# Altium project 4-Axile-Drone.PrjPcb
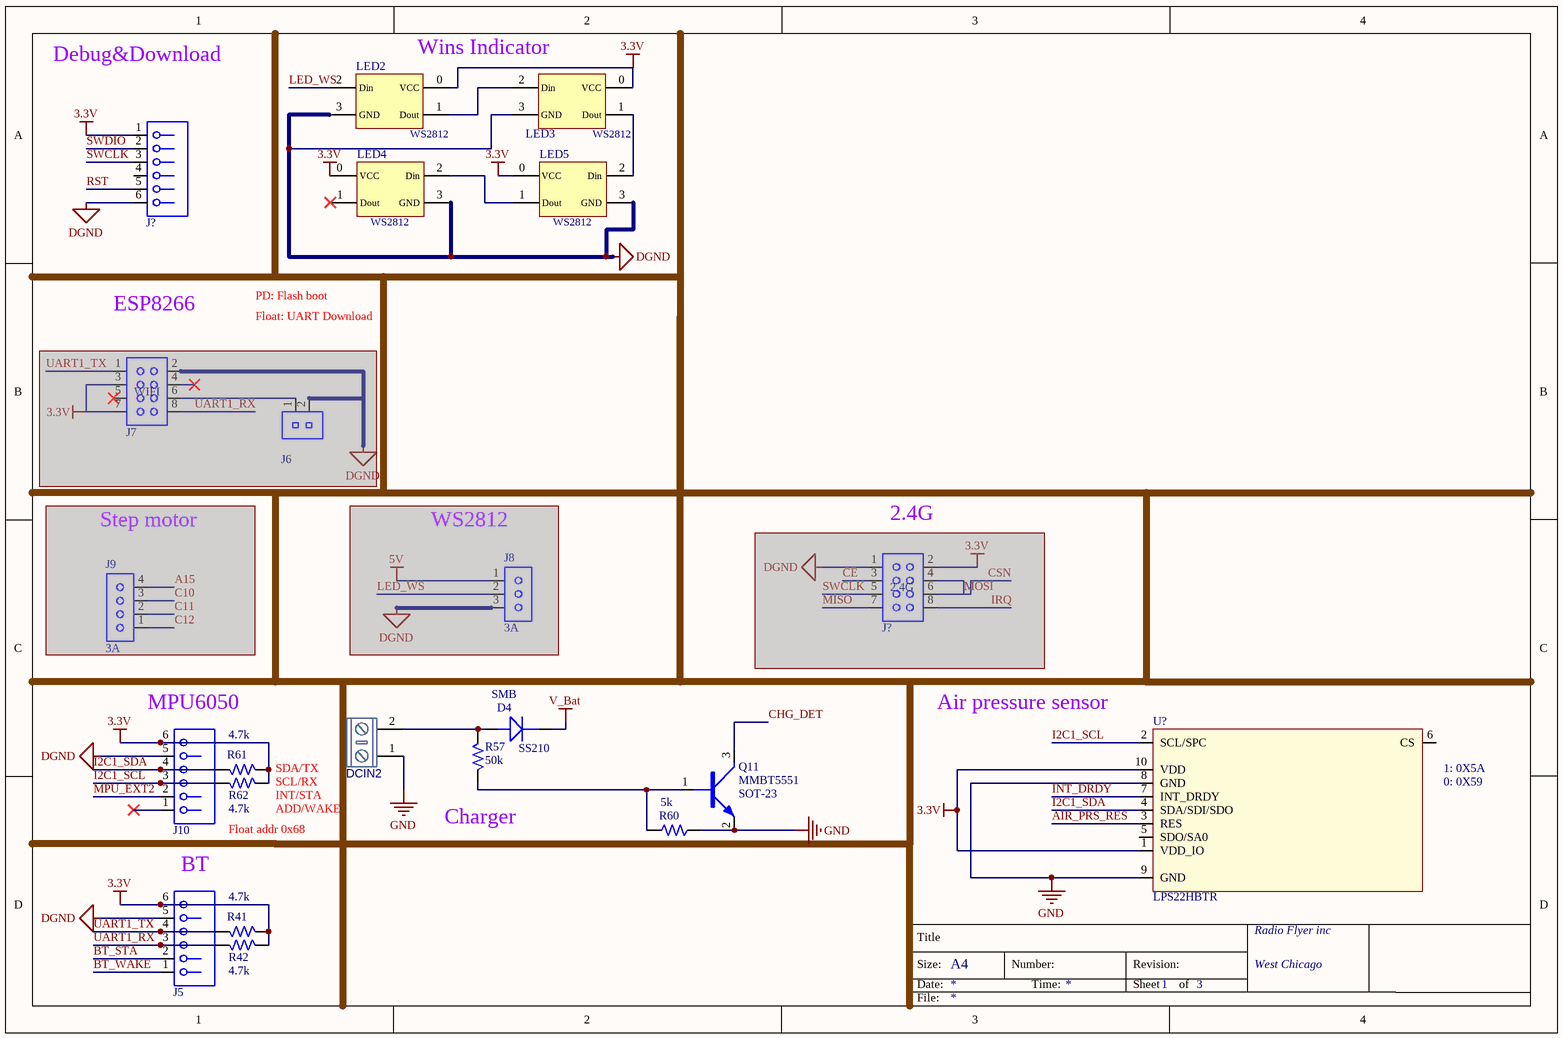
[diagram p0: Drone Connector.SchDoc]
3 sheets, 77 parts. Net scope: global (net labels, ports and power ports of the same name join across sheets).
Sheets:
  Drone Connector.SchDoc
  Done.SchDoc
  DroneMCU.SchDoc

## Sheet Drone Connector.SchDoc
size A4; Organization: Altium Limited; Address1: L3, 12a Rodborough Rd; Address2: Frenchs Forest; Address3: NSW; Address4: Australia 2086; SheetNumber: 1; SheetTotal: 3

### Parts
(Parts that share a designator on the sheet are numbered #1, #2 ... from top to bottom, then left to right.)
D4  RCD102100-0110  [SMB]  (value not drawn)
DCIN2  KF/WJ/DG 30x connecter  [KF/WJ/DG 301-2p-5.0mm]  (value not drawn)
J5  T690300121600  [CONN 6P PH=2.5mm RA XHB-6AW-KL]  (value not drawn)
J6  CCH254020-0102  [HOUSING 2P PH=2.54mm Jumper]  (value not drawn)  (masked out: inside a compile mask, not in the netlist)
J7  WIFI  [HEAD 8P 2X4 PH=2.54mm 90 H5mm_2.54-2X4AW-10.4]  (masked out: inside a compile mask, not in the netlist)
J8  Current: 3A  [HEAD 3P PH=2.54mm 180]  (hidden comment: CCP254010-0103)  (masked out: inside a compile mask, not in the netlist)
J9  Current: 3A  [HEAD 4P PH=2.54mm 180]  (hidden comment: CCP254260-0104)  (masked out: inside a compile mask, not in the netlist)
J10  T690300121600  [CONN 6P PH=2.5mm RA XHB-6AW-KL]  (value not drawn)
J?#1  T690300121600  [CONN 6P PH=2.5mm RA XHB-6AW-KL]  (value not drawn)
J?#2  2.4G  [HEAD 8P 2X4 PH=2.54mm 90 H5mm_2.54-2X4AW-10.4]  (masked out: inside a compile mask, not in the netlist)
LED2  WS2812  [WS2812]  (value not drawn)
LED3  WS2812  [WS2812]  (value not drawn)
LED4  WS2812  [WS2812]  (value not drawn)
LED5  WS2812  [WS2812]  (value not drawn)
Q11  Package: SOT-23  [SOT23-132-RW]  (hidden comment: RCN005551-0001)
R41  value 4.7k  [0603-RW]  (hidden comment: T5024421083A9)
R42  value 4.7k  [0603-RW]  (hidden comment: T5024421083A9)
R57  value 50k  [0603-RW]  (hidden comment: T5024421083A9)
R60  value 5k  [0603-RW]  (hidden comment: T5024421083A9)
R61  value 4.7k  [0603-RW]  (hidden comment: T5024421083A9)
R62  value 4.7k  [0603-RW]  (hidden comment: T5024421083A9)
U?  MFG Part: LPS22HBTR  [MSOP-10]  (hidden comment: T610300101698)

### Nets
3.3V: J5.6 J10.6 J?#1.1 LED2.0(VCC) LED3.0(VCC) LED4.0(VCC) LED5.0(VCC) R41.2 R42.2 R61.2 R62.2 U?.1(VDD_IO) U?.10(VDD)
DGND: J5.5 J10.5 J?#1.6 LED2.3(GND) LED3.3(GND) LED4.3(GND) LED5.3(GND)
GND: DCIN2.1 Q11.2(E) R60.2 U?.8(GND) U?.9(GND)
V_Bat: D4.2(K)
AIR_PRS_RES: U?.3(RES)
BT_STA: J5.2
BT_WAKE: J5.1
CHG_DET: Q11.3(C)
I2C1_SCL: J10.3 R62.1 U?.2(SCL/SPC)
I2C1_SDA: J10.4 R61.1 U?.4(SDA/SDI/SDO)
INT_DRDY: U?.7(INT_DRDY)  [project net I2C2_SDA]
LED_WS: LED2.2(Din)
MPU_EXT2: J10.2
RST: J?#1.5
SWCLK: J?#1.3
SWDIO: J?#1.2
UART1_RX: J5.3 R42.1
UART1_TX: J5.4 R41.1
NetD4_1: D4.1(A) DCIN2.2 R57.1
NetLED2_1: LED2.1(Dout) LED3.2(Din)
NetLED3_1: LED3.1(Dout) LED5.2(Din)
NetLED4_2: LED4.2(Din) LED5.1(Dout)
NetQ11_1: Q11.1(B) R57.2 R60.1

Not connected (* = marked no-connect by the designer): J10 1*; J?#1 4; LED4 1(Dout)*; U? 5(SDO/SA0) 6(CS)

### Notes on the sheet
- Debug&Download
- Wins Indicator
- ESP8266
- PD: Flash boot
- Float: UART Download
- (near J?#2) 2.4G
- Step motor
- (near J8) WS2812
- (near J10) MPU6050
- (near U?) Air pressure sensor
- SDA/TX
- SCL/RX
- (near U?) 1: 0X5A
- (near U?) 0: 0X59
- Float addr 0x68
- INT/STA
- ADD/WAKE
- (near R57) Charger
- BT
- Title
- Size:
- Date:
- A4
- Number:
- Time:
- Revision:
- Sheet
- of
- Radio Flyer inc
- West Chicago
- File:

### Library data of the parts
D4 = SS210: SWITC 100V 2A SS210 MIC G; SAP: T572005362246; Vendor Name: 深圳市春明电子有限公司; Vendor Code: 10020343; Type: DIODE; Optional: USD (和572004962246 交易幣別不一樣)帋ISHIDDEN=T|IS|IS|IS|IS|IS|IS; DIP&SMD: SMD; MFG: MIC; Voltage: 100V; Current: 2A; Customer Specific: N/A; MFG Part: SS210; Package: SMB
DCIN2 = KF/WJ/DG 30x: 接线端子 2Pin
J5 J10 J?#1 = CONN PH 6P PH=2.5mm RA XHB-6AW-KL: CONNECTOR 6PIN P=2.5 WHITE 90 K; Value: 2.5mm; MFG: 金佳电子; CREATE_NAME: Nathan; DIP&SMD: DIP; SAP: T690300121600; MFG Part: XHB-6AW-KL; Vendor Name: *; Vendor Code: *; Type: Connector; Current: *; CREATE_TIME: 27-Sep-2017
J6 = HOUSING 2P PH=2.54mm Jumper: HOUSING SIL Jumper 2P 90059-1007 Molex; Value: 2.54mm; SAP: T690300000900; Vendor Name: 深圳市利民丰电子有限公司; Vendor Code: 10020373; DIP&SMD: DIP; Current: 3A Jumper; MFG: *; MFG Part: *; Type: Connector
J7 J?#2 = HEAD 8P 2X4 PH=2.54mm 90 H5mm_2.54-2X4AW-10.4: 2X4P P:2.54MM 90° DIP K; Value: 2.54mm; SAP: T690300110000; MFG: JINJIA; CREATE_NAME: Nathan; MFG Part: 2.54-2X4AW-10.4; Vendor Name: *; Vendor Code: *; Type: Connector; Current: *; CREATE_TIME: 12-Sep-2017; DIP&SMD: DIP
J8 = HEAD 3P PH=2.54mm 180: HEAD PIN 3P P2.54*H11.6MM; Value: 2.54mm; SAP: T690300031100; Vendor Name: 深圳市利民丰电子有限公司; Vendor Code: 10020373; DIP&SMD: DIP; MFG: *; MFG Part: *; Type: Connector
J9 = HEAD 4P PH=2.54mm 180 H11.5mm: HEAD PIN 4P P2.54xH11.5MM; Value: 2.54mm; SAP: T690300023200; Vendor Name: 亿源电子有限公司; Vendor Code: 10009989; DIP&SMD: DIP; MFG: *; MFG Part: *; Type: Connector
Q11 = MMBT5551: XISTR NPN MMBT5551 SOT-23 FAIRCHILD; SAP: T581001790453; MFG: 宣瑜; Vendor Code: 10020343; Vendor Name: 深圳市春明电子有限公司; DIP&SMD: SMD; Power: *; Voltage: *; Type: NPN; Customer Specific: N/A; MFG Part: MMBT5551
R41 R42 R57 R60-R62 = RES0201 1/20W 1% 4.42K OHM_WALSIN: CHIP 4.42K OHM 200PPM +-1% 0201 WALS L; MFG Part: WR02X4421FAL; Power: 1/20W; MFG: WALSIN (華新); TOL: 1%; CREATE_NAME: Nathan; DIP&SMD: SMD; Vendor Code: *; SAP: T5024421083A9; Vendor Name: *; Type: Resistor; PACKAGE: 0603; CREATE_TIME: 23-July-2019; Customer Specific: N/A
U? = WT51F108S-MG10BWT: MCU WT51F108S-MG10BWT MSOP WELTREN K; MFG: Weltrend; CREATE_NAME: Nathan; DIP&SMD: SMD; Vendor Code: *; Vendor Name: *; SAP: T610300101698; Type: IC; CREATE_TIME: 04-Mar-2019; Customer Specific: N/A

## Sheet Done.SchDoc
size A4; Organization: Altium Limited; Address1: L3, 12a Rodborough Rd; Address2: Frenchs Forest; Address3: NSW; Address4: Australia 2086; SheetNumber: 1; SheetTotal: 2
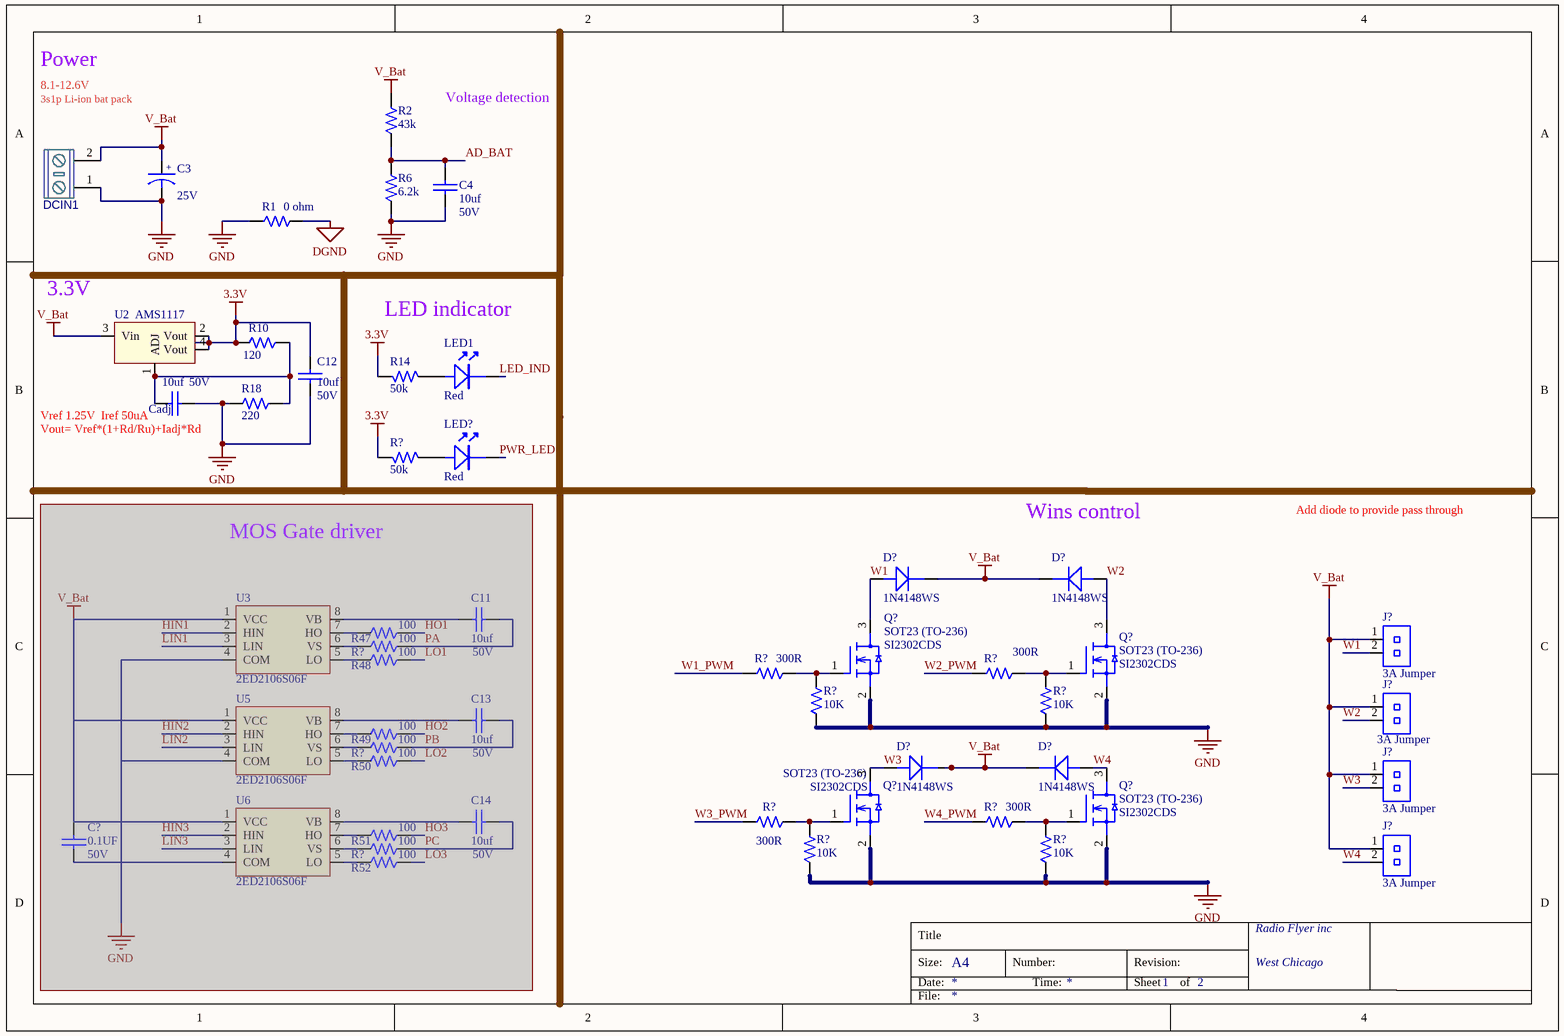
[diagram p1: Done.SchDoc]

### Parts
(Parts that share a designator on the sheet are numbered #1, #2 ... from top to bottom, then left to right.)
C3  Voltage: 25V  [CASE - G]  (hidden comment: PBE099550-4710)
C4  value 10uf  Voltage: 50V  [CAPC0603-RW]  (hidden comment: PXL456470-1530)
C11  value 10uf  Voltage: 50V  [CAPC0603-RW]  (hidden comment: PXL456470-1530)  (masked out: inside a compile mask, not in the netlist)
C12  value 10uf  Voltage: 50V  [CAPC0603-RW]  (hidden comment: PXL456470-1530)
C13  value 10uf  Voltage: 50V  [CAPC0603-RW]  (hidden comment: PXL456470-1530)  (masked out: inside a compile mask, not in the netlist)
C14  value 10uf  Voltage: 50V  [CAPC0603-RW]  (hidden comment: PXL456470-1530)  (masked out: inside a compile mask, not in the netlist)
C?  value 0.1UF  Voltage: 50V  [CAPC0603-RW]  (hidden comment: PXL456470-1530)  (masked out: inside a compile mask, not in the netlist)
Cadj  value 10uf  Voltage: 50V  [CAPC0603-RW]  (hidden comment: PXL456470-1530)
D?#1  RCD114148-0020  [SOD-323]  (value not drawn)
D?#2  RCD114148-0020  [SOD-323]  (value not drawn)
D?#3  RCD114148-0020  [SOD-323]  (value not drawn)
D?#4  RCD114148-0020  [SOD-323]  (value not drawn)
DCIN1  KF/WJ/DG 30x connecter  [KF/WJ/DG 301-2p-5.0mm]  (value not drawn)
J?#3  Current: 3A Jumper  [HOUSING 2P PH=2.54mm Jumper]  (hidden comment: CCH254020-0102)
J?#4  Current: 3A Jumper  [HOUSING 2P PH=2.54mm Jumper]  (hidden comment: CCH254020-0102)
J?#5  Current: 3A Jumper  [HOUSING 2P PH=2.54mm Jumper]  (hidden comment: CCH254020-0102)
J?#6  Current: 3A Jumper  [HOUSING 2P PH=2.54mm Jumper]  (hidden comment: CCH254020-0102)
LED1  Color: Red  [LED1206-RED]  (hidden comment: LED1206R_23-21\R6C-AM1N2AY\2A)
LED?  Color: Red  [LED1206-RED]  (hidden comment: LED1206R_23-21\R6C-AM1N2AY\2A)
Q?#1  Package: SOT23 (TO-236)  [SOT23-132-RW]  (hidden comment: SI2302CDS)
Q?#2  Package: SOT23 (TO-236)  [SOT23-132-RW]  (hidden comment: SI2302CDS)
Q?#3  Package: SOT23 (TO-236)  [SOT23-132-RW]  (hidden comment: SI2302CDS)
Q?#4  Package: SOT23 (TO-236)  [SOT23-132-RW]  (hidden comment: SI2302CDS)
R1  value 0 ohm  [0603-RW]  (hidden comment: T502210202399)
R2  value 43k  [0603-RW]  (hidden comment: T5024421083A9)
R6  value 6.2k  [0603-RW]  (hidden comment: T5024421083A9)
R10  value 120  [0603-RW]  (hidden comment: T5024421083A9)
R14  value 50k  [0603-RW]  (hidden comment: T5024421083A9)
R18  value 220  [0603-RW]  (hidden comment: T5024421083A9)
R47  value 100  [0603-RW]  (hidden comment: T5024421083A9)  (masked out: inside a compile mask, not in the netlist)
R48  value 100  [0603-RW]  (hidden comment: T5024421083A9)  (masked out: inside a compile mask, not in the netlist)
R49  value 100  [0603-RW]  (hidden comment: T5024421083A9)  (masked out: inside a compile mask, not in the netlist)
R50  value 100  [0603-RW]  (hidden comment: T5024421083A9)  (masked out: inside a compile mask, not in the netlist)
R51  value 100  [0603-RW]  (hidden comment: T5024421083A9)  (masked out: inside a compile mask, not in the netlist)
R52  value 100  [0603-RW]  (hidden comment: T5024421083A9)  (masked out: inside a compile mask, not in the netlist)
R?#1  value 50k  [0603-RW]  (hidden comment: T5024421083A9)
R?#2  value 100  [0603-RW]  (hidden comment: T5024421083A9)  (masked out: inside a compile mask, not in the netlist)
R?#3  value 300R  [0603-RW]  (hidden comment: T5024421083A9)
R?#4  value 10K  [0603-RW]  (hidden comment: T5024421083A9)
R?#5  value 300R  [0603-RW]  (hidden comment: T5024421083A9)
R?#6  value 10K  [0603-RW]  (hidden comment: T5024421083A9)
R?#7  value 100  [0603-RW]  (hidden comment: T5024421083A9)  (masked out: inside a compile mask, not in the netlist)
R?#8  value 300R  [0603-RW]  (hidden comment: T5024421083A9)
R?#9  value 10K  [0603-RW]  (hidden comment: T5024421083A9)
R?#10  value 300R  [0603-RW]  (hidden comment: T5024421083A9)
R?#11  value 10K  [0603-RW]  (hidden comment: T5024421083A9)
R?#12  value 100  [0603-RW]  (hidden comment: T5024421083A9)  (masked out: inside a compile mask, not in the netlist)
U2  AMS1117  [SOT223]
U3  T610900027257  [SO8]  (value not drawn)  (masked out: inside a compile mask, not in the netlist)
U5  T610900027257  [SO8]  (value not drawn)  (masked out: inside a compile mask, not in the netlist)
U6  T610900027257  [SO8]  (value not drawn)  (masked out: inside a compile mask, not in the netlist)

### Nets
3.3V: C12.1 R10.2 R14.1 R?#1.1 U2.2(Vout) U2.4(Vout)
DGND: R1.2
GND: C3.2 C4.2 C12.2 Cadj.2 DCIN1.1 Q?#1.2(S) Q?#2.2(S) Q?#3.2(S) Q?#4.2(S) R1.1 R6.2 R18.2 R?#4.2 R?#6.2 R?#9.2 R?#11.2
V_Bat: C3.1 D?#1.2(K) D?#2.2(K) D?#3.2(K) D?#4.2(K) DCIN1.2 J?#3.1 J?#4.1 J?#5.1 J?#6.1 R2.1 U2.3(Vin)
AD_BAT: C4.1 R2.2 R6.1
LED_IND: LED1.2(K)
PWR_LED: LED?.2(K)
W1: D?#1.1(A) J?#3.2 Q?#1.3(D)
W1_PWM: R?#3.1
W2: D?#2.1(A) J?#4.2 Q?#2.3(D)
W2_PWM: R?#5.1
W3: D?#3.1(A) J?#5.2 Q?#3.3(D)
W3_PWM: R?#8.1
W4: D?#4.1(A) J?#6.2 Q?#4.3(D)
W4_PWM: R?#10.1
NetCadj_1: Cadj.1 R10.1 R18.1 U2.1(ADJ)
NetLED1_1: LED1.1(A) R14.2
NetLED?_1: LED?.1(A) R?#1.2
NetQ?#1_1: Q?#1.1(G) R?#3.2 R?#4.1
NetQ?#2_1: Q?#2.1(G) R?#5.2 R?#6.1
NetQ?#3_1: Q?#3.1(G) R?#8.2 R?#9.1
NetQ?#4_1: Q?#4.1(G) R?#10.2 R?#11.1

### Notes on the sheet
- Power
- 3s1p Li-ion bat pack
- 8.1-12.6V
- Voltage detection
- (near U2) 3.3V
- LED indicator
- (near Cadj) Vref 1.25V  Iref 50uA
- (near Cadj) Vout= Vref*(1+Rd/Ru)+Iadj*Rd
- Wins control
- Add diode to provide pass through
- MOS Gate driver
- Title
- Size:
- Date:
- A4
- Number:
- Time:
- Revision:
- Sheet
- of
- Radio Flyer inc
- West Chicago
- File:
- (in symbol CAP E 470uF 25V 20% SMD) +

### Library data of the parts
C3 = CAP E 470uF 25V 20% SMD: CHIP ELECT 470uF 25V 20% D10xL10 105; SAP: T551471445000; Vendor Name: 东莞市晴远电子有限公司; Vendor Code: 10010262; Type: Capacitor; DIP&SMD: SMD; PACKAGE: CASE - G; MFG: *; MFG Part: *; Other: *; Tolerance: 20%; Customer Specific: N/A
C4 C11-C14 C? = CAP0603 0.015uF 50V 10%: GP CHIP CAP 0.015uF 50V 10% 0603 TYPE X7R; SAP: T542021537508; Vendor Code: 10010262; Vendor Name: 东莞市晴远电子有限公司; Type: Capacitor; DIP&SMD: SMD; PACKAGE: CAPC0603; MFG: *; MFG Part: *; Other: X7R; Tolerance: 10%; Customer Specific: N/A
Cadj = CAP0603 0.015uF 50V 10%: GP CHIP CAP 0.015uF 50V 10% 0603 TYPE X7R; SAP: T542021537508; Vendor Code: 10010262; Vendor Name: 东莞市晴远电子有限公司; DIP&SMD: SMD; PACKAGE: CAPC0603; MFG: *; MFG Part: *; Other: X7R; Tolerance: 10%; Type: Capacitor; Customer Specific: N/A
D?#1-D?#4 = 1N4148WS: DIODE SW 1N4148 VF=0.7V SOD-323; MFG: TW SEMICONDUCTOR; SAP: T572005070208; Voltage: 100V; Current: 150MA; DIP&SMD: SMD; Vendor Name: *; Vendor Code: *; Type: DIODE; Package: SOD-323; Customer Specific: N/A; MFG Part: 1N4148WS
DCIN1 = KF/WJ/DG 30x: 接线端子 2Pin
J?#3-J?#6 = HOUSING 2P PH=2.54mm Jumper: HOUSING SIL Jumper 2P 90059-1007 Molex; Value: 2.54mm; SAP: T690300000900; Vendor Name: 深圳市利民丰电子有限公司; Vendor Code: 10020373; DIP&SMD: DIP; MFG: *; MFG Part: *; Type: Connector
LED1 LED? = LED1206R_23-21\R6C-AM1N2AY\2A: CHIP LED RED TYPE 1206; MFG: EVERLIGHT; DIP&SMD: SMD; CREATE_NAME: Nathan; MFG Part: 23-21\R6C-AM1N2AY\2A; SAP: *; Package: 1206; Type: LED; CREATE_TIME: 18-Aug-2020
Q?#1-Q?#4 = SI2302CDS: NMOS FET-Si2302CDS; MFG: VISHAY; CREATE_NAME: Nathan; DIP&SMD: SMD; SAP: *; Power: *; Vendor Code: *; Vendor Name: *; Voltage: *; Current: *; Type: NMOS; CREATE_TIME: 17-Nov-2020; Customer Specific: N/A; MFG Part: SI2302CDS
R1 = RES0603 1/16W 1% 21K OMH_WALSIN: CHIP 21K OHM 100PPM +-1% 0603 WALS L; TOL: 1%; MFG: WALSIN (華新); Power: 1/10W; CREATE_NAME: Nathan; DIP&SMD: SMD; SAP: T502210202399; Package: 0603; MFG Part: *; Vendor Code: *; Vendor Name: *; Type: Resistor; CREATE_TIME: 08-Feb-2018; Customer Specific: N/A
R2 R6 R10 R14 R18 R47-R52 R?#1-R?#12 = RES0201 1/20W 1% 4.42K OHM_WALSIN: as R41 on sheet Drone Connector; Vendor Code: *; SAP: T5024421083A9; Vendor Name: *; Type: Resistor; PACKAGE: 0603; CREATE_TIME: 23-July-2019; Customer Specific: N/A
U2 = AMS1117: 800mA LOW DROPOUT VOLTAGE REGULATOR , SOT-223; MFG: Advanced Monolithic Systems; CREATE_NAME: Nathan; DIP&SMD: SMD; SAP: *; Vendor Code: *; Vendor Name: *; Type: IC; CREATE_TIME: 17-Nov-2020; Package: SOT-223; Customer Specific: N/A; MFG Part: AMS1117
U3 U5 U6 = 2ED2106S06F: DRIVER 2ED2106S06F DSO-8 INFINEO K; MFG: Infineon; CREATE_NAME: Nathan; DIP&SMD: SMD; Vendor Code: *; Vendor Name: *; SAP: T610900027257; Type: IC; CREATE_TIME: 14-Apr-2020; Customer Specific: N/A; MFG Part: 2ED2106S06F

## Sheet DroneMCU.SchDoc
size A4; SheetNumber: 3; SheetTotal: 3
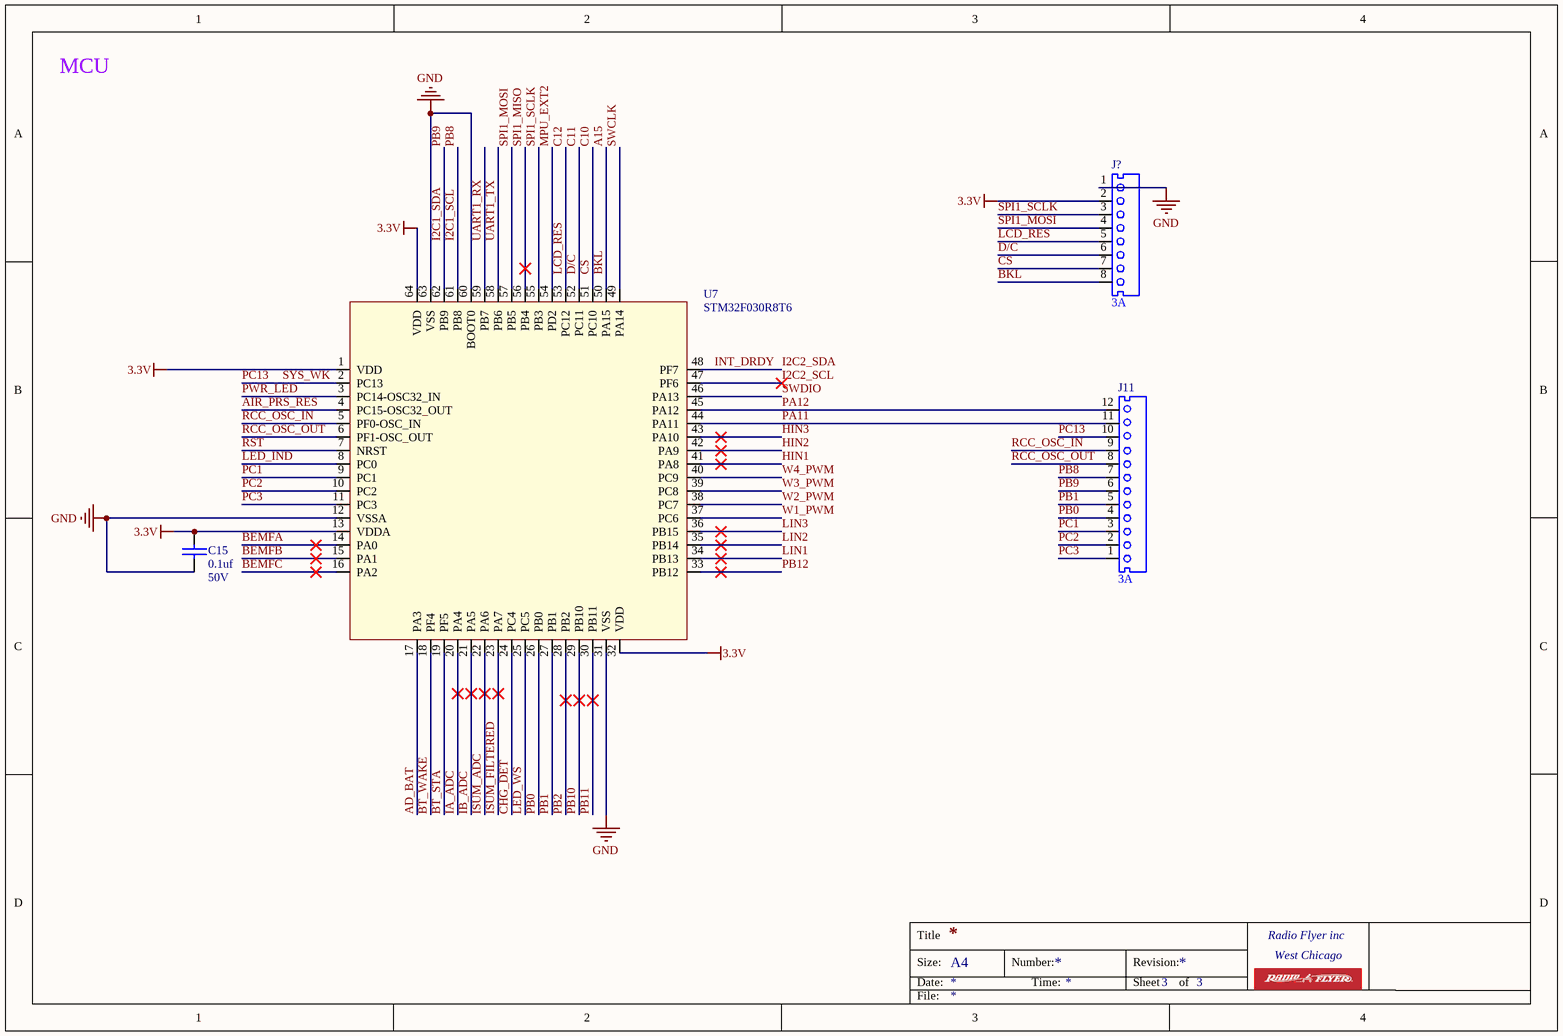
[diagram p2: DroneMCU.SchDoc]

### Parts
(Parts that share a designator on the sheet are numbered #1, #2 ... from top to bottom, then left to right.)
C15  value 0.1uf  Voltage: 50V  [CAPC0603-RW]  (hidden comment: PXL456470-1530)
J11  Current: 3A  [CONN 12P PH=2.5 ST HAA250A-12A]  (hidden comment: T690300029300)
J?#7  Current: 3A  [CONN 8P PH=2.5 ST TJC3-8A-CS]  (hidden comment: T690300135100)
U7  MFG Part: STM32F030R8T6  [QFP50P1200X1200X160-64N]  (hidden comment: T610300097225)

### Nets
3.3V: C15.2 J?#7.2 U7.1(VDD) U7.13(VDDA) U7.32(VDD) U7.64(VDD)
GND: C15.1 J?#7.1 U7.12(VSSA) U7.31(VSS) U7.60(BOOT0) U7.63(VSS)
A15: J?#7.8 U7.50(PA15)  [also labelled BKL]
AD_BAT: U7.17(PA3)
AIR_PRS_RES: U7.4(PC15-OSC32_OUT)
BEMFA: U7.14(PA0)
BEMFB: U7.15(PA1)
BEMFC: U7.16(PA2)
BT_STA: U7.19(PF5)
BT_WAKE: U7.18(PF4)
C10: J?#7.7 U7.51(PC10)  [also labelled CS]
C11: J?#7.6 U7.52(PC11)  [also labelled D/C]
C12: J?#7.5 U7.53(PC12)  [also labelled LCD_RES]
CHG_DET: U7.24(PC4)
HIN1: U7.41(PA8)
HIN2: U7.42(PA9)
HIN3: U7.43(PA10)
I2C1_SCL: J11.7 U7.61(PB8)  [also labelled PB8]
I2C1_SDA: J11.6 U7.62(PB9)  [also labelled PB9]
I2C2_SCL: U7.47(PF6)
I2C2_SDA: U7.48(PF7)  [also labelled INT_DRDY]
IA_ADC: U7.20(PA4)
IB_ADC: U7.21(PA5)
ISUM_ADC: U7.22(PA6)
ISUM_FILTERED: U7.23(PA7)
LED_IND: U7.8(PC0)
LED_WS: U7.25(PC5)
LIN1: U7.34(PB13)
LIN2: U7.35(PB14)
LIN3: U7.36(PB15)
MPU_EXT2: U7.54(PD2)
PA11: J11.11 U7.44(PA11)
PA12: J11.12 U7.45(PA12)
PB0: J11.4 U7.26(PB0)
PB1: J11.5 U7.27(PB1)
PB2: U7.28(PB2)
PB10: U7.29(PB10)
PB11: U7.30(PB11)
PB12: U7.33(PB12)
PC1: J11.3 U7.9(PC1)
PC2: J11.2 U7.10(PC2)
PC3: J11.1 U7.11(PC3)
PC13: J11.10 U7.2(PC13)  [also labelled SYS_WK]
PWR_LED: U7.3(PC14-OSC32_IN)
RCC_OSC_IN: J11.9 U7.5(PF0-OSC_IN)
RCC_OSC_OUT: J11.8 U7.6(PF1-OSC_OUT)
RST: U7.7(NRST)
SPI1_MISO: U7.56(PB4)
SPI1_MOSI: J?#7.4 U7.57(PB5)
SPI1_SCLK: J?#7.3 U7.55(PB3)
SWCLK: U7.49(PA14)
SWDIO: U7.46(PA13)
UART1_RX: U7.59(PB7)
UART1_TX: U7.58(PB6)
W1_PWM: U7.37(PC6)
W2_PWM: U7.38(PC7)
W3_PWM: U7.39(PC8)
W4_PWM: U7.40(PC9)

### Notes on the sheet
- MCU
- Title
- Size:
- Date:
- A4
- Number:
- Time:
- Revision:
- Sheet
- of
- Radio Flyer inc
- West Chicago
- File:

### Library data of the parts
C15 = CAP0603 0.015uF 50V 10%: as C4 on sheet Done; PACKAGE: CAPC0603; MFG: *; MFG Part: *; Other: X7R; Tolerance: 10%; Customer Specific: N/A
J11 = CONN 12P PH=2.5 ST HAA250A-12A: CONNECTOR 12 PIN P:2.5MM P2.54-12 K; Value: 2.5mm; MFG: 金科基; CREATE_NAME: Nathan; DIP&SMD: DIP; SAP: T690300029300; MFG Part: HAA250A-12A; Vendor Name: *; Vendor Code: *; Type: Connector; CREATE_TIME: 10-Aug-2017
J?#7 = CONN 8P PH=2.5 ST TJC3-8A-CS: CONN 8PIN P2.5 M\180 TJC3-8A-CS K; Value: 2.5mm; MFG: JINJIA; CREATE_NAME: Nathan; DIP&SMD: DIP; SAP: T690300135100; MFG Part: TJC3-8A-CS; Vendor Name: *; Vendor Code: *; Type: Connector; CREATE_TIME: 21-Mar-2018
U7 = STM32F030RCT6TR: MCU STM32F030RCT6TR LQFP64 ST K; MFG: ST     (STM意法半導體); CREATE_NAME: Nathan; DIP&SMD: SMD; SAP: T610300097225; Type: IC; CREATE_TIME: 02-NOV-2017; Customer Specific: N/A

## Nets that join several sheets
3.3V: Drone Connector (13 pins), Done (6 pins), DroneMCU (6 pins)
DGND: Drone Connector (7 pins), Done (R1.2)
GND: Drone Connector (5 pins), Done (16 pins), DroneMCU (6 pins)
V_Bat: Drone Connector (D4.2), Done (12 pins)
AD_BAT: Done (C4.1 R2.2 R6.1), DroneMCU (U7.17)
AIR_PRS_RES: Drone Connector (U?.3), DroneMCU (U7.4)
BT_STA: Drone Connector (J5.2), DroneMCU (U7.19)
BT_WAKE: Drone Connector (J5.1), DroneMCU (U7.18)
CHG_DET: Drone Connector (Q11.3), DroneMCU (U7.24)
I2C1_SCL: Drone Connector (J10.3 R62.1 U?.2), DroneMCU (J11.7 U7.61)
I2C1_SDA: Drone Connector (J10.4 R61.1 U?.4), DroneMCU (J11.6 U7.62)
I2C2_SDA: Drone Connector (U?.7), DroneMCU (U7.48)
LED_IND: Done (LED1.2), DroneMCU (U7.8)
LED_WS: Drone Connector (LED2.2), DroneMCU (U7.25)
MPU_EXT2: Drone Connector (J10.2), DroneMCU (U7.54)
PWR_LED: Done (LED?.2), DroneMCU (U7.3)
RST: Drone Connector (J?#1.5), DroneMCU (U7.7)
SWCLK: Drone Connector (J?#1.3), DroneMCU (U7.49)
SWDIO: Drone Connector (J?#1.2), DroneMCU (U7.46)
UART1_RX: Drone Connector (J5.3 R42.1), DroneMCU (U7.59)
UART1_TX: Drone Connector (J5.4 R41.1), DroneMCU (U7.58)
W1_PWM: Done (R?#3.1), DroneMCU (U7.37)
W2_PWM: Done (R?#5.1), DroneMCU (U7.38)
W3_PWM: Done (R?#8.1), DroneMCU (U7.39)
W4_PWM: Done (R?#10.1), DroneMCU (U7.40)